# Altium project CNC_interfaces_board.PrjPcb
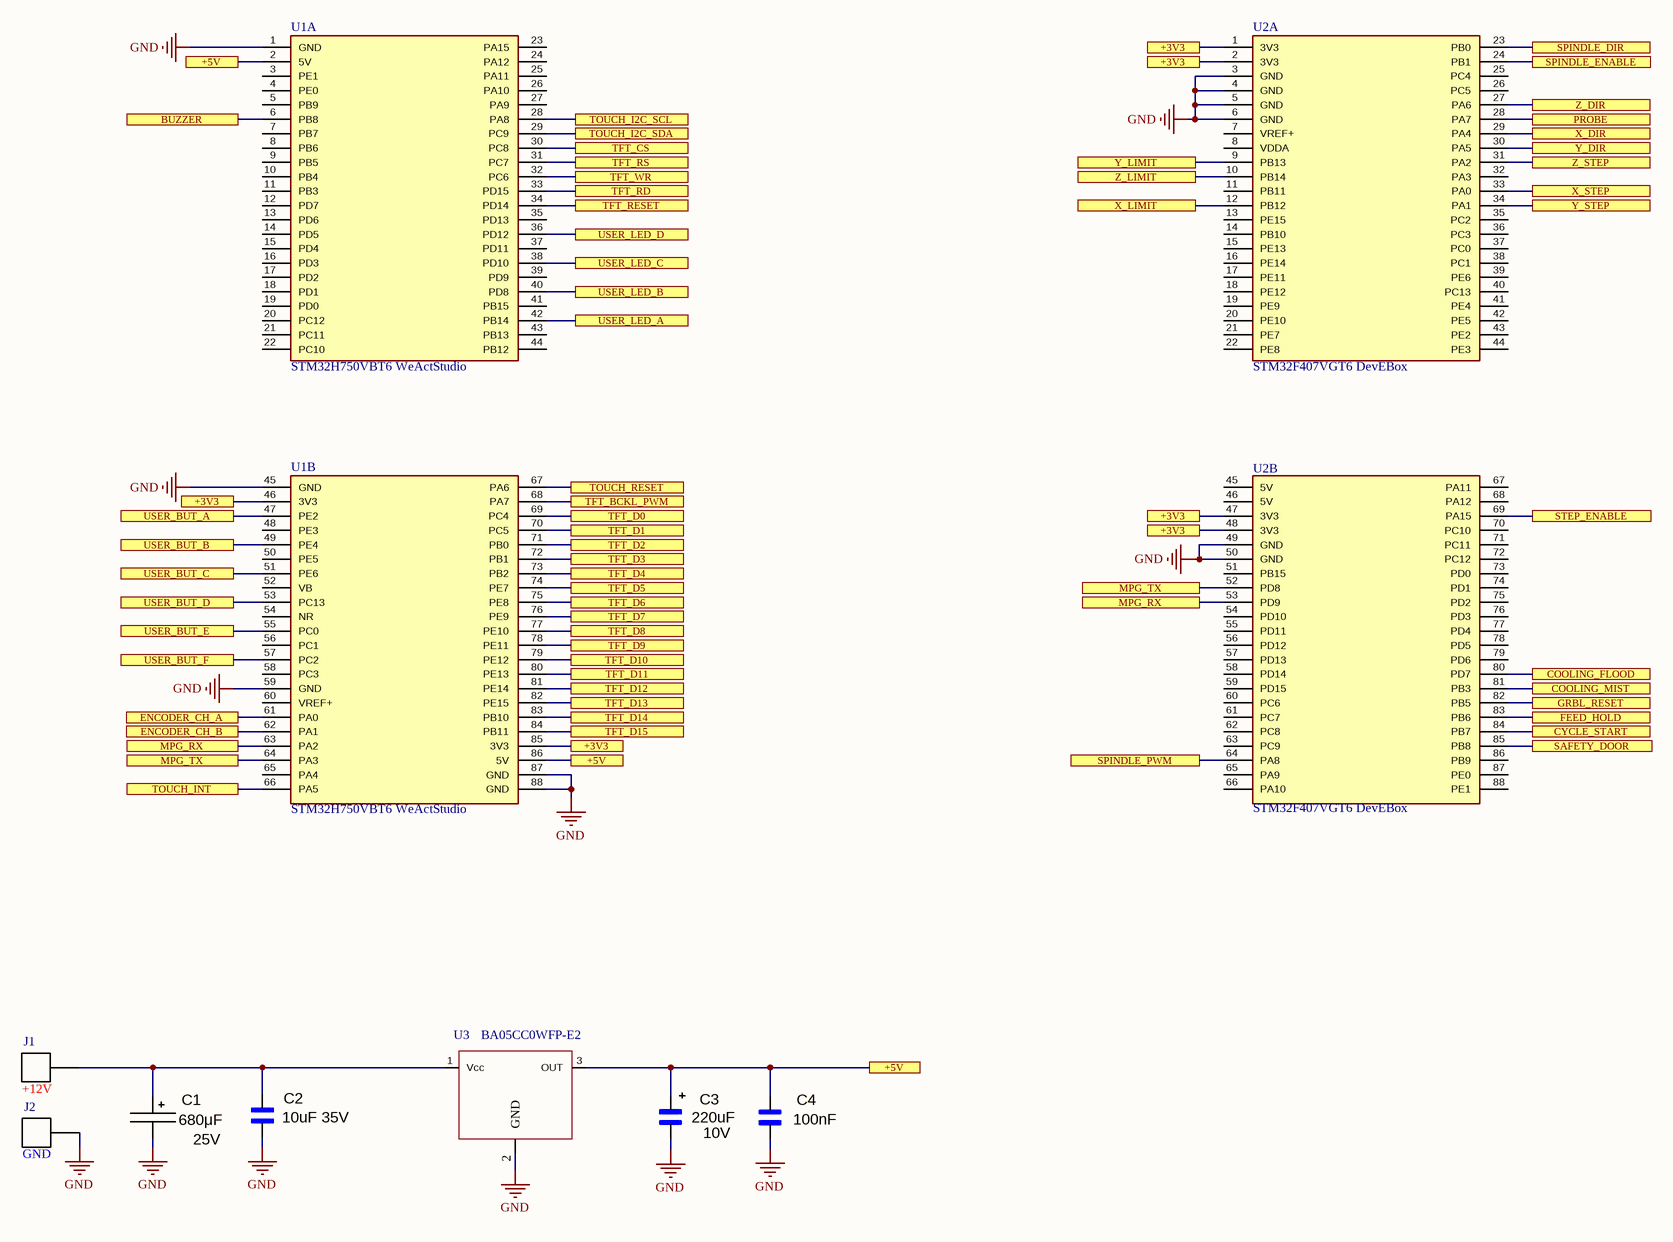
[diagram p0: Sheet1.SchDoc]
5 sheets, 122 parts. Net scope: flat (ports and power ports of the same name join across sheets).
Board file: PCB2.PcbDoc
Sheets:
  Sheet1.SchDoc
  Sheet2.SchDoc
  Sheet3.SchDoc
  Sheet4.SchDoc
  Sheet5.SchDoc

## Sheet Sheet1.SchDoc: Наименование
size 420 x 297 mm; ApprovedBy: Vasil; CheckedBy: Vasil; Author: Vasil; CompanyName: Vasil; DrawnBy: n.a.; Engineer: Vasil; SheetNumber: 1; SheetTotal: 5; PageSetup: Record=PageOptions|CenterHorizontal=True|CenterVertical=True|PrintScale=0.94|XCorrection=1.00|YCorrection=1.00|PrintKind=1|BorderSize=5000000|LeftOffset=0|BottomOffset=0|Orientation=1|PaperLength=1000|PaperWidth=1000|Scale=100|PaperSource=7|PrintQuality=-4|MediaType=1|DitherType=10|PaperKind=A4|PrintScaleMode=1; DecimalNumber: 000.00006.001.VG; HeadOfSector: n.a.; MainDevice: HW; Name: CNC control panel; DocumentName: Sheet1.SCHDOC

### Parts
C1  value 680μF  Voltage: 25V  [CAP 10x16]  (hidden comment: 680μF / 25V)
C2  10uF 35V  [*CAPC3326X230N]
C3  Voltage: 10V  [SMD 7343-43]  (hidden comment: 220uF)
C4  100nF  [SMD 0603]
J1  +12V  [Wire]
J2  GND  [Wire]
U1  STM32H750VBT6 WeActStudio  [WeActStudio STM32H750VBT6]  (parts A,B of 2)
U2  STM32F407VGT6 DevEBox  [DevEBox V3.0 STM32F407VGT6]  (parts A,B of 2)
U3  BA05CC0WFP-E2  [DPAK228P968X238-4N]

### Ports
+3V3, +5V, BUZZER, COOLING_FLOOD, COOLING_MIST, CYCLE_START, ENCODER_CH_A, ENCODER_CH_B, FEED_HOLD, GRBL_RESET, MPG_RX, MPG_TX, PROBE, SAFETY_DOOR, SPINDLE_DIR, SPINDLE_ENABLE, SPINDLE_PWM, STEP_ENABLE, TFT_BCKL_PWM, TFT_CS, TFT_D0, TFT_D1, TFT_D2, TFT_D3, TFT_D4, TFT_D5, TFT_D6, TFT_D7, TFT_D8, TFT_D9, TFT_D10, TFT_D11, TFT_D12, TFT_D13, TFT_D14, TFT_D15, TFT_RD, TFT_RESET, TFT_RS, TFT_WR, TOUCH_I2C_SCL, TOUCH_I2C_SDA, TOUCH_INT, TOUCH_RESET, USER_BUT_A, USER_BUT_B, USER_BUT_C, USER_BUT_D, USER_BUT_E, USER_BUT_F, USER_LED_A, USER_LED_B, USER_LED_C, USER_LED_D, X_DIR, X_LIMIT, X_STEP, Y_DIR, Y_LIMIT, Y_STEP, Z_DIR, Z_LIMIT, Z_STEP

### Nets
GND: C1.2 C2.1 C3.2 C4.1 J2.1 U1.1(GND) U1.45(GND) U1.59(GND) U1.87(GND) U1.88(GND) U2.3(GND) U2.4(GND) U2.5(GND) U2.6(GND) U2.49(GND) U2.50(GND) U3.2(GND)
NetC1_1: C1.1 C2.2 J1.1 U3.1(Vcc)
NetC3_1: C3.1 C4.2 U1.2(5V) U1.86(5V) U3.3(OUT) ; port +5V
NetJ3_6: U1.46(3V3) U1.85(3V3) U2.1(3V3) U2.2(3V3) U2.47(3V3) U2.48(3V3) ; port +3V3
NetJ3_9: U1.30(PC8) ; port TFT_CS
NetJ3_10: U1.31(PC7) ; port TFT_RS
NetJ3_11: U1.32(PC6) ; port TFT_WR
NetJ3_12: U1.33(PD15) ; port TFT_RD
NetJ3_15: U1.34(PD14) ; port TFT_RESET
NetJ3_17: U1.69(PC4) ; port TFT_D0
NetJ3_18: U1.70(PC5) ; port TFT_D1
NetJ3_19: U1.71(PB0) ; port TFT_D2
NetJ3_20: U1.72(PB1) ; port TFT_D3
NetJ3_21: U1.73(PB2) ; port TFT_D4
NetJ3_22: U1.74(PE7) ; port TFT_D5
NetJ3_23: U1.75(PE8) ; port TFT_D6
NetJ3_24: U1.76(PE9) ; port TFT_D7
NetJ3_25: U1.77(PE10) ; port TFT_D8
NetJ3_26: U1.78(PE11) ; port TFT_D9
NetJ3_27: U1.79(PE12) ; port TFT_D10
NetJ3_28: U1.80(PE13) ; port TFT_D11
NetJ3_29: U1.81(PE14) ; port TFT_D12
NetJ3_30: U1.82(PE15) ; port TFT_D13
NetJ3_31: U1.83(PB10) ; port TFT_D14
NetJ3_32: U1.84(PB11) ; port TFT_D15
NetJ8_2: U1.28(PA8) ; port TOUCH_I2C_SCL
NetJ8_3: U1.29(PC9) ; port TOUCH_I2C_SDA
NetJ8_4: U1.66(PA5) ; port TOUCH_INT
NetJ8_5: U1.67(PA6) ; port TOUCH_RESET
NetJ10_1: U1.62(PA1) ; port ENCODER_CH_B
NetJ10_2: U1.61(PA0) ; port ENCODER_CH_A
NetQ2_3: U2.82(PB5) ; port GRBL_RESET
NetQ4_3: U2.12(PB12) ; port X_LIMIT
NetQ5_3: U2.9(PB13) ; port Y_LIMIT
NetQ6_3: U2.10(PB14) ; port Z_LIMIT
NetQ7_3: U2.28(PA7) ; port PROBE
NetQ9_3: U2.83(PB6) ; port FEED_HOLD
NetQ10_3: U2.84(PB7) ; port CYCLE_START
NetQ11_3: U2.85(PB8) ; port SAFETY_DOOR
NetQ15_1: U2.24(PB1) ; port SPINDLE_ENABLE
NetQ16_1: U2.23(PB0) ; port SPINDLE_DIR
NetQ17_1: U2.64(PA8) ; port SPINDLE_PWM
NetQ18_1: U2.33(PA0) ; port X_STEP
NetQ19_1: U2.34(PA1) ; port Y_STEP
NetQ20_1: U2.31(PA2) ; port Z_STEP
NetQ22_1: U2.29(PA4) ; port X_DIR
NetQ23_1: U2.30(PA5) ; port Y_DIR
NetQ24_1: U2.27(PA6) ; port Z_DIR
NetQ26_1: U2.69(PA15) ; port STEP_ENABLE
NetR10_2: U1.47(PE2) ; port USER_BUT_A
NetR11_2: U1.49(PE4) ; port USER_BUT_B
NetR12_2: U1.51(PE6) ; port USER_BUT_C
NetR13_2: U1.53(PC13) ; port USER_BUT_D
NetR14_2: U1.55(PC0) ; port USER_BUT_E
NetR15_2: U1.57(PC2) ; port USER_BUT_F
NetR16_1: U1.42(PB14) ; port USER_LED_A
NetR17_1: U1.40(PD8) ; port USER_LED_B
NetR18_1: U1.38(PD10) ; port USER_LED_C
NetR19_1: U1.36(PD12) ; port USER_LED_D
NetR20_1: U1.6(PB8) ; port BUZZER
NetR46_1: U2.81(PB3) ; port COOLING_MIST
NetR47_1: U2.80(PD7) ; port COOLING_FLOOD
NetR56_1: U1.68(PA7) ; port TFT_BCKL_PWM
NetU1_63: U1.63(PA2) U2.53(PD9) ; port MPG_RX
NetU1_64: U1.64(PA3) U2.52(PD8) ; port MPG_TX

Not connected (* = marked no-connect by the designer): U1 3(PE1) 4(PE0) 5(PB9) 7(PB7) 8(PB6) 9(PB5) 10(PB4) 11(PB3) 12(PD7) 13(PD6) 14(PD5) 15(PD4) 16(PD3) 17(PD2) 18(PD1) 19(PD0) 20(PC12) 21(PC11) 22(PC10) 23(PA15) 24(PA12) 25(PA11) 26(PA10) 27(PA9) 35(PD13) 37(PD11) 39(PD9) 41(PB15) 43(PB13) 44(PB12) 48(PE3) 50(PE5) 52(VB) 54(NR) 56(PC1) 58(PC3) 60(VREF+) 65(PA4); U2 7(VREF+) 8(VDDA) 11(PB11) 13(PE15) 14(PB10) 15(PE13) 16(PE14) 17(PE11) 18(PE12) 19(PE9) 20(PE10) 21(PE7) 22(PE8) 25(PC4) 26(PC5) 32(PA3) 35(PC2) 36(PC3) 37(PC0) 38(PC1) 39(PE6) 40(PC13) 41(PE4) 42(PE5) 43(PE2) 44(PE3) 45(5V) 46(5V) 51(PB15) 54(PD10) 55(PD11) 56(PD12) 57(PD13) 58(PD14) 59(PD15) 60(PC6) 61(PC7) 62(PC8) 63(PC9) 65(PA9) 66(PA10) 67(PA11) 68(PA12) 70(PC10) 71(PC11) 72(PC12) 73(PD0) 74(PD1) 75(PD2) 76(PD3) 77(PD4) 78(PD5) 79(PD6) 86(PB9) 87(PE0) 88(PE1)

### Notes on the sheet
- Перв.примен.
- Справ.№
- Подп. и дата
- Инв.№ дубл.
- Взам.инв.№
- Подп.и дата
- Разраб.
- Изм.
- Лист
- № докум.
- Подп.
- Дата
- Лит.
- Масштаб
- Масса
- Т.контр.
- Пров.
- СХЕМА   ЭЛЕКТРИЧЕСКАЯ
- ПРИНЦИПИАЛЬНАЯ
- Листов
- Инв.№ подл.
- Утв.
- Н.контр.
- Нач.сект.
- Формат  A3

### Library data of the parts
C1 = CAP Aluminium: Manufacturer: FUJICON; Tipe: Low ESR; Case: ТМ1V221M-RBF16; Package: 8x16x3.5; HelpURL: https://store.comet.bg/Catalogue/Product/6157/; Temperature: -55...+105°C
C2 C4 = CL32B106KLJNNNE: C1210 10uF 35V X7R; Manufacturer: SAMSUNG ELECTRO-MECHANICS; HelpURL: https://store.comet.bg/Catalogue/Product/36844/; Model: CL32B106KLJNNNE; Case: SMD 1210
  C2: Value: 10uF; Voltage: 35V
  C4: Value: 100nF
C3 = Cap Tant 220uF 10V Case E: Cap Tant Solid 220uF 10V E CASE 10% _7.3 X 4.3 X 4mm_ SMD 7343-43 0.1 Ohm 125В°C T/R; Manufacturer: VISHAY; Model: 593D227X9010E2TE3; HalpURL: https://store.comet.bg/Catalogue/Product/15617/; Package: SMD 7343-43   7.3 x 4.3 x 4; Value: 220uF
J1 J2 = Wire
U3 = BA05CC0FP-E2: LDO Regulator; Manufacturer: ROHM Semiconductor; Model: BA05CC0WFP-E2; HelpURL: https://store.comet.bg/Catalogue/Product/4871/; Case: TO252-5-11

## Sheet Sheet2.SchDoc: Наименование
size 420 x 297 mm; ApprovedBy: Vasil; CheckedBy: Vasil; Author: Vasil; CompanyName: Vasil; DrawnBy: n.a.; Engineer: Vasil; SheetNumber: 2; SheetTotal: 5; PageSetup: Record=PageOptions|CenterHorizontal=True|CenterVertical=True|PrintScale=0.94|XCorrection=1.00|YCorrection=1.00|PrintKind=1|BorderSize=5000000|LeftOffset=0|BottomOffset=0|Orientation=1|PaperLength=1000|PaperWidth=1000|Scale=100|PaperSource=7|PrintQuality=-4|MediaType=1|DitherType=10|PaperKind=A4|PrintScaleMode=1; DecimalNumber: 000.00006.001.VG; HeadOfSector: n.a.; MainDevice: HW; Name: CNC_interfaces_board; DocumentName: Sheet1.SCHDOC
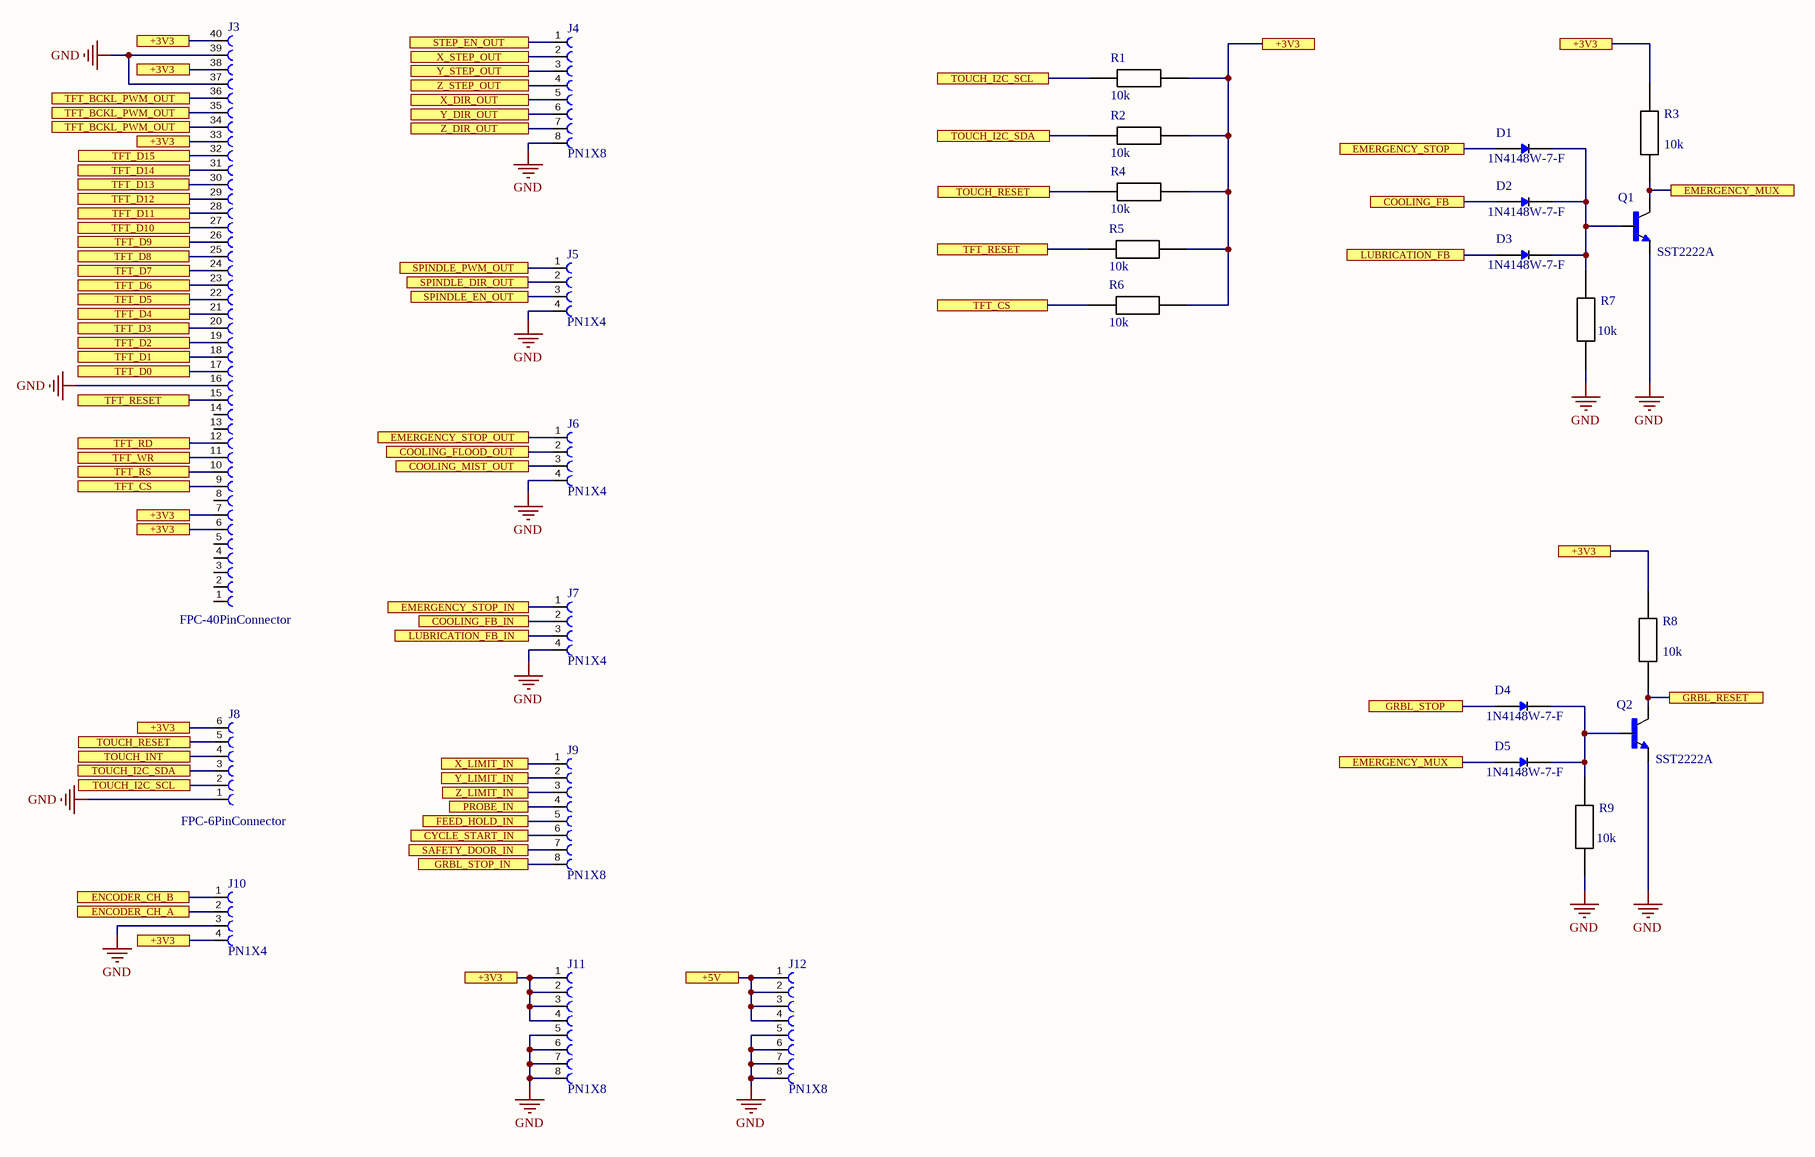
[diagram p1: Sheet2.SchDoc]

### Parts
D1  1N4148W-7-F  [SOD123]
D2  1N4148W-7-F  [SOD123]
D3  1N4148W-7-F  [SOD123]
D4  1N4148W-7-F  [SOD123]
D5  1N4148W-7-F  [SOD123]
J3  FPC-40PinConnector  [687140149022]
J4  PN1X8  [PN1X8]
J5  PN1X4  [PN1X4]
J6  PN1X4  [PN1X4]
J7  PN1X4  [PN1X4]
J8  FPC-6PinConnector  [687106149022]
J9  PN1X8  [PN1X8]
J10  PN1X4  [PN1X4]
J11  PN1X8  [PN1X8]
J12  PN1X8  [PN1X8]
Q1  SST2222A  [SOT-23-3]
Q2  SST2222A  [SOT-23-3]
R1  10k  [SMD 0805]
R2  10k  [SMD 0805]
R3  10k  [SMD 0805]
R4  10k  [SMD 0805]
R5  10k  [SMD 0805]
R6  10k  [SMD 0805]
R7  10k  [SMD 0805]
R8  10k  [SMD 0805]
R9  10k  [SMD 0805]

### Ports
+3V3, +5V, COOLING_FB, COOLING_FB_IN, COOLING_FLOOD_OUT, COOLING_MIST_OUT, CYCLE_START_IN, EMERGENCY_MUX, EMERGENCY_STOP, EMERGENCY_STOP_IN, EMERGENCY_STOP_OUT, ENCODER_CH_A, ENCODER_CH_B, FEED_HOLD_IN, GRBL_RESET, GRBL_STOP, GRBL_STOP_IN, LUBRICATION_FB, LUBRICATION_FB_IN, PROBE_IN, SAFETY_DOOR_IN, SPINDLE_DIR_OUT, SPINDLE_EN_OUT, SPINDLE_PWM_OUT, STEP_EN_OUT, TFT_BCKL_PWM_OUT, TFT_CS, TFT_D0, TFT_D1, TFT_D2, TFT_D3, TFT_D4, TFT_D5, TFT_D6, TFT_D7, TFT_D8, TFT_D9, TFT_D10, TFT_D11, TFT_D12, TFT_D13, TFT_D14, TFT_D15, TFT_RD, TFT_RESET, TFT_RS, TFT_WR, TOUCH_I2C_SCL, TOUCH_I2C_SDA, TOUCH_INT, TOUCH_RESET, X_DIR_OUT, X_LIMIT_IN, X_STEP_OUT, Y_DIR_OUT, Y_LIMIT_IN, Y_STEP_OUT, Z_DIR_OUT, Z_LIMIT_IN, Z_STEP_OUT

### Nets
GND: J3.16 J3.37 J3.39 J4.8 J5.4 J6.4 J7.4 J8.1 J10.3 J11.5 J11.6 J11.7 J11.8 J12.5 J12.6 J12.7 J12.8 Q1.2(E) Q2.2(E) R7.2 R9.2
Net1_4: J6.3 ; port COOLING_MIST_OUT
Net2_4: J6.2 ; port COOLING_FLOOD_OUT
Net3_4: J6.1 ; port EMERGENCY_STOP_OUT
NetC3_1: J12.1 J12.2 J12.3 J12.4 ; port +5V
NetD1_A: D1.A ; port EMERGENCY_STOP
NetD1_C: D1.C(K) D2.C(K) D3.C(K) Q1.1(B) R7.1
NetD2_A: D2.A ; port COOLING_FB
NetD3_A: D3.A ; port LUBRICATION_FB
NetD4_A: D4.A ; port GRBL_STOP
NetD4_C: D4.C(K) D5.C(K) Q2.1(B) R9.1
NetD5_A: D5.A Q1.3(C) R3.2 ; port EMERGENCY_MUX
NetJ3_6: J3.6 J3.7 J3.33 J3.38 J3.40 J8.6 J10.4 J11.1 J11.2 J11.3 J11.4 R1.1 R2.2 R3.1 R4.2 R5.1 R6.1 R8.1 ; port +3V3
NetJ3_9: J3.9 R6.2 ; port TFT_CS
NetJ3_10: J3.10 ; port TFT_RS
NetJ3_11: J3.11 ; port TFT_WR
NetJ3_12: J3.12 ; port TFT_RD
NetJ3_15: J3.15 R5.2 ; port TFT_RESET
NetJ3_17: J3.17 ; port TFT_D0
NetJ3_18: J3.18 ; port TFT_D1
NetJ3_19: J3.19 ; port TFT_D2
NetJ3_20: J3.20 ; port TFT_D3
NetJ3_21: J3.21 ; port TFT_D4
NetJ3_22: J3.22 ; port TFT_D5
NetJ3_23: J3.23 ; port TFT_D6
NetJ3_24: J3.24 ; port TFT_D7
NetJ3_25: J3.25 ; port TFT_D8
NetJ3_26: J3.26 ; port TFT_D9
NetJ3_27: J3.27 ; port TFT_D10
NetJ3_28: J3.28 ; port TFT_D11
NetJ3_29: J3.29 ; port TFT_D12
NetJ3_30: J3.30 ; port TFT_D13
NetJ3_31: J3.31 ; port TFT_D14
NetJ3_32: J3.32 ; port TFT_D15
NetJ3_34: J3.34 J3.35 J3.36 ; port TFT_BCKL_PWM_OUT
NetJ4_1: J4.1 ; port STEP_EN_OUT
NetJ4_2: J4.2 ; port X_STEP_OUT
NetJ4_3: J4.3 ; port Y_STEP_OUT
NetJ4_4: J4.4 ; port Z_STEP_OUT
NetJ4_5: J4.5 ; port X_DIR_OUT
NetJ4_6: J4.6 ; port Y_DIR_OUT
NetJ4_7: J4.7 ; port Z_DIR_OUT
NetJ5_1: J5.1 ; port SPINDLE_PWM_OUT
NetJ5_2: J5.2 ; port SPINDLE_DIR_OUT
NetJ5_3: J5.3 ; port SPINDLE_EN_OUT
NetJ7_1: J7.1 ; port EMERGENCY_STOP_IN
NetJ7_2: J7.2 ; port COOLING_FB_IN
NetJ7_3: J7.3 ; port LUBRICATION_FB_IN
NetJ8_2: J8.2 R1.2 ; port TOUCH_I2C_SCL
NetJ8_3: J8.3 R2.1 ; port TOUCH_I2C_SDA
NetJ8_4: J8.4 ; port TOUCH_INT
NetJ8_5: J8.5 R4.1 ; port TOUCH_RESET
NetJ9_1: J9.1 ; port X_LIMIT_IN
NetJ9_2: J9.2 ; port Y_LIMIT_IN
NetJ9_3: J9.3 ; port Z_LIMIT_IN
NetJ9_4: J9.4 ; port PROBE_IN
NetJ9_5: J9.5 ; port FEED_HOLD_IN
NetJ9_6: J9.6 ; port CYCLE_START_IN
NetJ9_7: J9.7 ; port SAFETY_DOOR_IN
NetJ9_8: J9.8 ; port GRBL_STOP_IN
NetJ10_1: J10.1 ; port ENCODER_CH_B
NetJ10_2: J10.2 ; port ENCODER_CH_A
NetQ2_3: Q2.3(C) R8.2 ; port GRBL_RESET

Not connected (* = marked no-connect by the designer): J3 1(40) 2(39) 3(38) 4(37) 5(36) 8(33) 13(28) 14(27)

### Notes on the sheet
- Перв.примен.
- Справ.№
- Подп. и дата
- Инв.№ дубл.
- Взам.инв.№
- Подп.и дата
- Разраб.
- Изм.
- Лист
- № докум.
- Подп.
- Дата
- Лит.
- Масштаб
- Масса
- Т.контр.
- Пров.
- СХЕМА   ЭЛЕКТРИЧЕСКАЯ
- ПРИНЦИПИАЛЬНАЯ
- Листов
- Инв.№ подл.
- Утв.
- Н.контр.
- Нач.сект.
- Формат  A3

### Library data of the parts
D1-D5 = 1N4148W-7-F: Diode Standard 100V 300mA _DC_ Surface Mount SOD-123; MF: DIODES / ZETEX; HelpURL: https://store.comet.bg/Catalogue/Product/9613/; Model: 1N4148W-7-F; Case: SOD-123 Diodes Inc.; Value: 1N4148W-7-F
J3 = FPC-40PinConnector: 40 Position FFC, FPC Connector Contacts, Bottom 0.020 (0.50mm) Surface Mount, Right Angle; MF: Wurth Electronics; Value: FPC-40PinConnector; Check_prices: https://www.snapeda.com/parts/687140149022/Wurth+Electronics+Inc./view-part/?ref=eda; MP: 687140149022; Purchase-URL: https://pricing.snapeda.com/search/part/687140149022/?ref=eda; Price: None; Availability: In Stock; Package: None; SnapEDA_Link: https://www.snapeda.com/parts/687140149022/Wurth+Electronics+Inc./view-part/?ref=snap
J4 J9 J11 J12 = PN1X8: Single Row / Straight / Without Shroud Female header Female 8 ¦ WÃ¼rth Elektronik 61300711821 @ Pin header, socket _Si...; MF: WÃ¼rth Elektronik; Value: PN1X8; Price: None; MP: 61300711821; SnapEDA_Link: https://www.snapeda.com/parts/61300711821/W%C3%BCrth%20Elektronik/view-part/2704590/?ref=snap; Package: None; Availability: Unavailable
J5-J7 J10 = PN1X4: Single Row / Straight / Without Shroud Female header Female 4 @ Pin header, socket _Si...; MF: WÃ¼rth Elektronik; MP: 61300711821; Value: PN1X4; Price: None; SnapEDA_Link: https://www.snapeda.com/parts/61300711821/W%C3%BCrth%20Elektronik/view-part/2704590/?ref=snap; Package: None; Availability: Unavailable
J8 = FPC-6PinConnector: 6 Position FFC, FPC Connector Contacts, Bottom 0.020 (0.50mm) Surface Mount, Right Angle; MF: WÃ¼rth Elektronik; MP: 687106149022; Purchase-URL: https://pricing.snapeda.com/search/part/687106149022/?ref=eda; Price: None; SnapEDA_Link: https://www.snapeda.com/parts/687106149022/Wurth+Elektronik/view-part/?ref=snap; Check_prices: https://www.snapeda.com/parts/687106149022/Wurth+Elektronik/view-part/?ref=eda; Package: None; Availability: In Stock; Value: FPC-6PinConnector
Q1 Q2 = SST2222A: Transistor NPN 40V 600mA 300MHz 350mW; Manufacturer: ROHM Semiconductor; Case: SOT-23-3 SST3; HelpURL: https://store.comet.bg/Catalogue/Product/23715/; Value: SST2222A
R1-R9 = Resistor_1: RES; HelpURL: https://store.comet.bg/Catalogue/RES/Resistors/#eyJpcHAiOiIxMDAiLCJtIjoiIn0%3D; Value: 10k

## Sheet Sheet3.SchDoc: Наименование
size 420 x 297 mm; ApprovedBy: Vasil; CheckedBy: Vasil; Author: Vasil; CompanyName: Vasil; DrawnBy: n.a.; Engineer: Vasil; SheetNumber: 3; SheetTotal: 5; PageSetup: Record=PageOptions|CenterHorizontal=True|CenterVertical=True|PrintScale=0.94|XCorrection=1.00|YCorrection=1.00|PrintKind=1|BorderSize=5000000|LeftOffset=0|BottomOffset=0|Orientation=1|PaperLength=1000|PaperWidth=1000|Scale=100|PaperSource=7|PrintQuality=-4|MediaType=1|DitherType=10|PaperKind=A4|PrintScaleMode=1; DecimalNumber: 000.00006.001.VG; HeadOfSector: n.a.; MainDevice: HW; Name: CNC_interfaces_board; DocumentName: Sheet1.SCHDOC
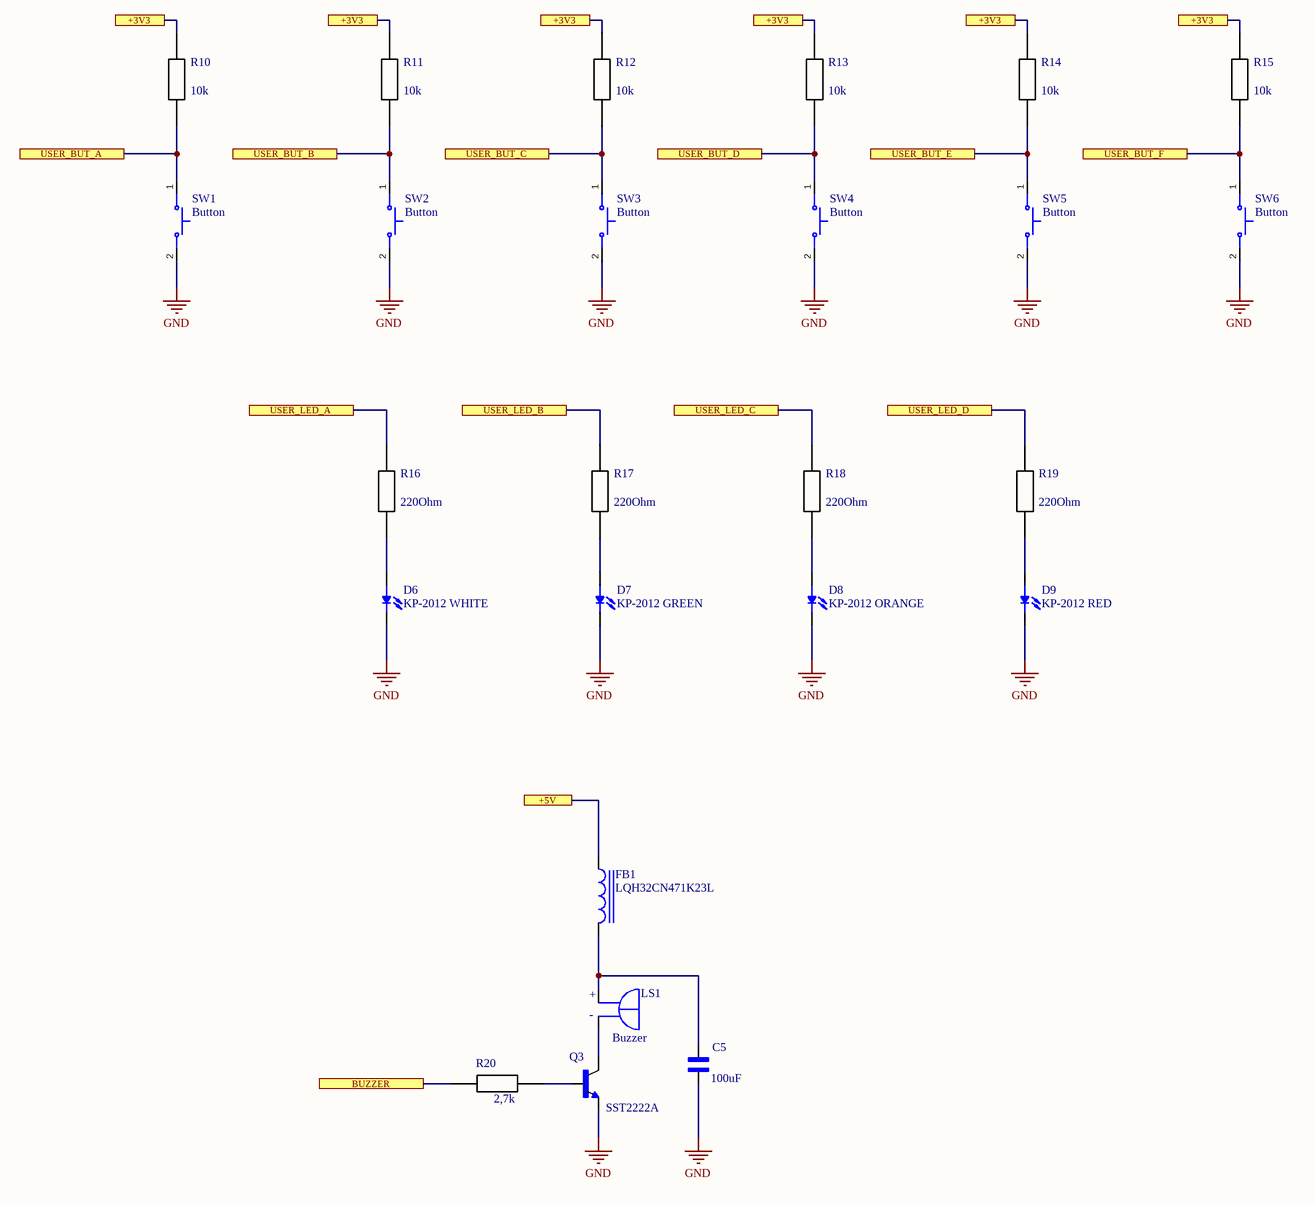
[diagram p2: Sheet3.SchDoc]

### Parts
C5  100uF  [*CAPC3326X230N]
D6  KP-2012 WHITE  [SMD 0805 LED-Y]
D7  KP-2012 GREEN  [SMD 0805 LED-Y]
D8  KP-2012 ORANGE  [SMD 0805 LED-Y]
D9  KP-2012 RED  [SMD 0805 LED-Y]
FB1  LQH32CN471K23L  [SMD 1210 LQH]
LS1  Buzzer  [XDCR_KSSG13J12-N]
Q3  SST2222A  [SOT-23-3]
R10  10k  [SMD 0805]
R11  10k  [SMD 0805]
R12  10k  [SMD 0805]
R13  10k  [SMD 0805]
R14  10k  [SMD 0805]
R15  10k  [SMD 0805]
R16  220Ohm  [SMD 0805]
R17  220Ohm  [SMD 0805]
R18  220Ohm  [SMD 0805]
R19  220Ohm  [SMD 0805]
R20  2,7k  [SMD 0805]
SW1  Button  [SW_KSR221GLFS]
SW2  Button  [SW_KSR221GLFS]
SW3  Button  [SW_KSR221GLFS]
SW4  Button  [SW_KSR221GLFS]
SW5  Button  [SW_KSR221GLFS]
SW6  Button  [SW_KSR221GLFS]

### Ports
+3V3, +5V, BUZZER, USER_BUT_A, USER_BUT_B, USER_BUT_C, USER_BUT_D, USER_BUT_E, USER_BUT_F, USER_LED_A, USER_LED_B, USER_LED_C, USER_LED_D

### Nets
GND: C5.1 D6.C D7.C D8.C D9.C Q3.2(E) SW1.2 SW2.2 SW3.2 SW4.2 SW5.2 SW6.2
NetC3_1: FB1.1 ; port +5V
NetC5_2: C5.2 FB1.2 LS1.P(POS)
NetD6_A: D6.A R16.2
NetD7_A: D7.A R17.2
NetD8_A: D8.A R18.2
NetD9_A: D9.A R19.2
NetJ3_6: R10.1 R11.1 R12.1 R13.1 R14.1 R15.1 ; port +3V3
NetLS1_N: LS1.N(NEG) Q3.3(C)
NetQ3_1: Q3.1(B) R20.2
NetR10_2: R10.2 SW1.1 ; port USER_BUT_A
NetR11_2: R11.2 SW2.1 ; port USER_BUT_B
NetR12_2: R12.2 SW3.1 ; port USER_BUT_C
NetR13_2: R13.2 SW4.1 ; port USER_BUT_D
NetR14_2: R14.2 SW5.1 ; port USER_BUT_E
NetR15_2: R15.2 SW6.1 ; port USER_BUT_F
NetR16_1: R16.1 ; port USER_LED_A
NetR17_1: R17.1 ; port USER_LED_B
NetR18_1: R18.1 ; port USER_LED_C
NetR19_1: R19.1 ; port USER_LED_D
NetR20_1: R20.1 ; port BUZZER

### Notes on the sheet
- Перв.примен.
- Справ.№
- Подп. и дата
- Инв.№ дубл.
- Взам.инв.№
- Подп.и дата
- Разраб.
- Изм.
- Лист
- № докум.
- Подп.
- Дата
- Лит.
- Масштаб
- Масса
- Т.контр.
- Пров.
- СХЕМА   ЭЛЕКТРИЧЕСКАЯ
- ПРИНЦИПИАЛЬНАЯ
- Листов
- Инв.№ подл.
- Утв.
- Н.контр.
- Нач.сект.
- Формат  A3
- (in symbol KSSG13J12-N) +; -

### Library data of the parts
C5 = CL32B106KLJNNNE: as C2 on sheet Sheet1; HelpURL: https://store.comet.bg/Catalogue/Product/36844/; Model: CL32B106KLJNNNE; Case: SMD 1210; Value: 100uF
D6-D9 = KP-2012: LED 2.0x1.25mm, 50-160 mcd@20mA, W.Clear, 120°; MP: SMLMN2WB1CW1C; MF: Rohm Semiconductor; SnapEDA_Link: https://www.snapeda.com/parts/SMLMN2WB1CW1C/Rohm/view-part/3217279/?ref=snap; Availability: Unavailable; Value: KP-2012; Price: None; Package: 0805 Rohm Semiconductor
FB1 = LQH32CN471K23L: 470uH 19Ohm 60mA 10%    47uH 1.3Ohm 170mA 10%; MF: MURATA ELECTRONICS; Package: 1210; MP: LQH32CN471K; URL 47uH: https://store.comet.bg/Catalogue/Product/48001/; URL 470uH: https://store.comet.bg/Catalogue/Product/48004/; Value: LQH32CN471K23L
LS1 = KSSG13J12-N: Availability: Unavailable; Price: None; Package: None; Value: Buzzer; MP: KSSG13J12-N
Q3 = SST2222A: as Q1 on sheet Sheet2; Case: SOT-23-3 SST3; HelpURL: https://store.comet.bg/Catalogue/Product/23715/; Value: SST2222A
R10-R20 = Resistor_1: RES; HelpURL: https://store.comet.bg/Catalogue/RES/Resistors/#eyJpcHAiOiIxMDAiLCJtIjoiIn0%3D
  R10-R15: Value: 10k
  R16-R19: Value: 220Ohm
  R20: Value: 2,7k
SW1-SW6 = KSR221GLFS: Tactile Switch 2p SPST-NO 50mA/32V 6x3.8x2.5mm; MF: C&K; MP: KSR221GLFS; Package: 6x3.8x2.5mm; URL: https://store.comet.bg/Catalogue/Product/17512/; Value: Button

## Sheet Sheet4.SchDoc: Наименование
size 420 x 297 mm; ApprovedBy: Vasil; CheckedBy: Vasil; Author: Vasil; CompanyName: Vasil; DrawnBy: n.a.; Engineer: Vasil; SheetNumber: 4; SheetTotal: 5; PageSetup: Record=PageOptions|CenterHorizontal=True|CenterVertical=True|PrintScale=0.94|XCorrection=1.00|YCorrection=1.00|PrintKind=1|BorderSize=5000000|LeftOffset=0|BottomOffset=0|Orientation=1|PaperLength=1000|PaperWidth=1000|Scale=100|PaperSource=7|PrintQuality=-4|MediaType=1|DitherType=10|PaperKind=A4|PrintScaleMode=1; DecimalNumber: 000.00006.001.VG; HeadOfSector: n.a.; MainDevice: HW; Name: CNC_interfaces_board; DocumentName: Sheet1.SCHDOC
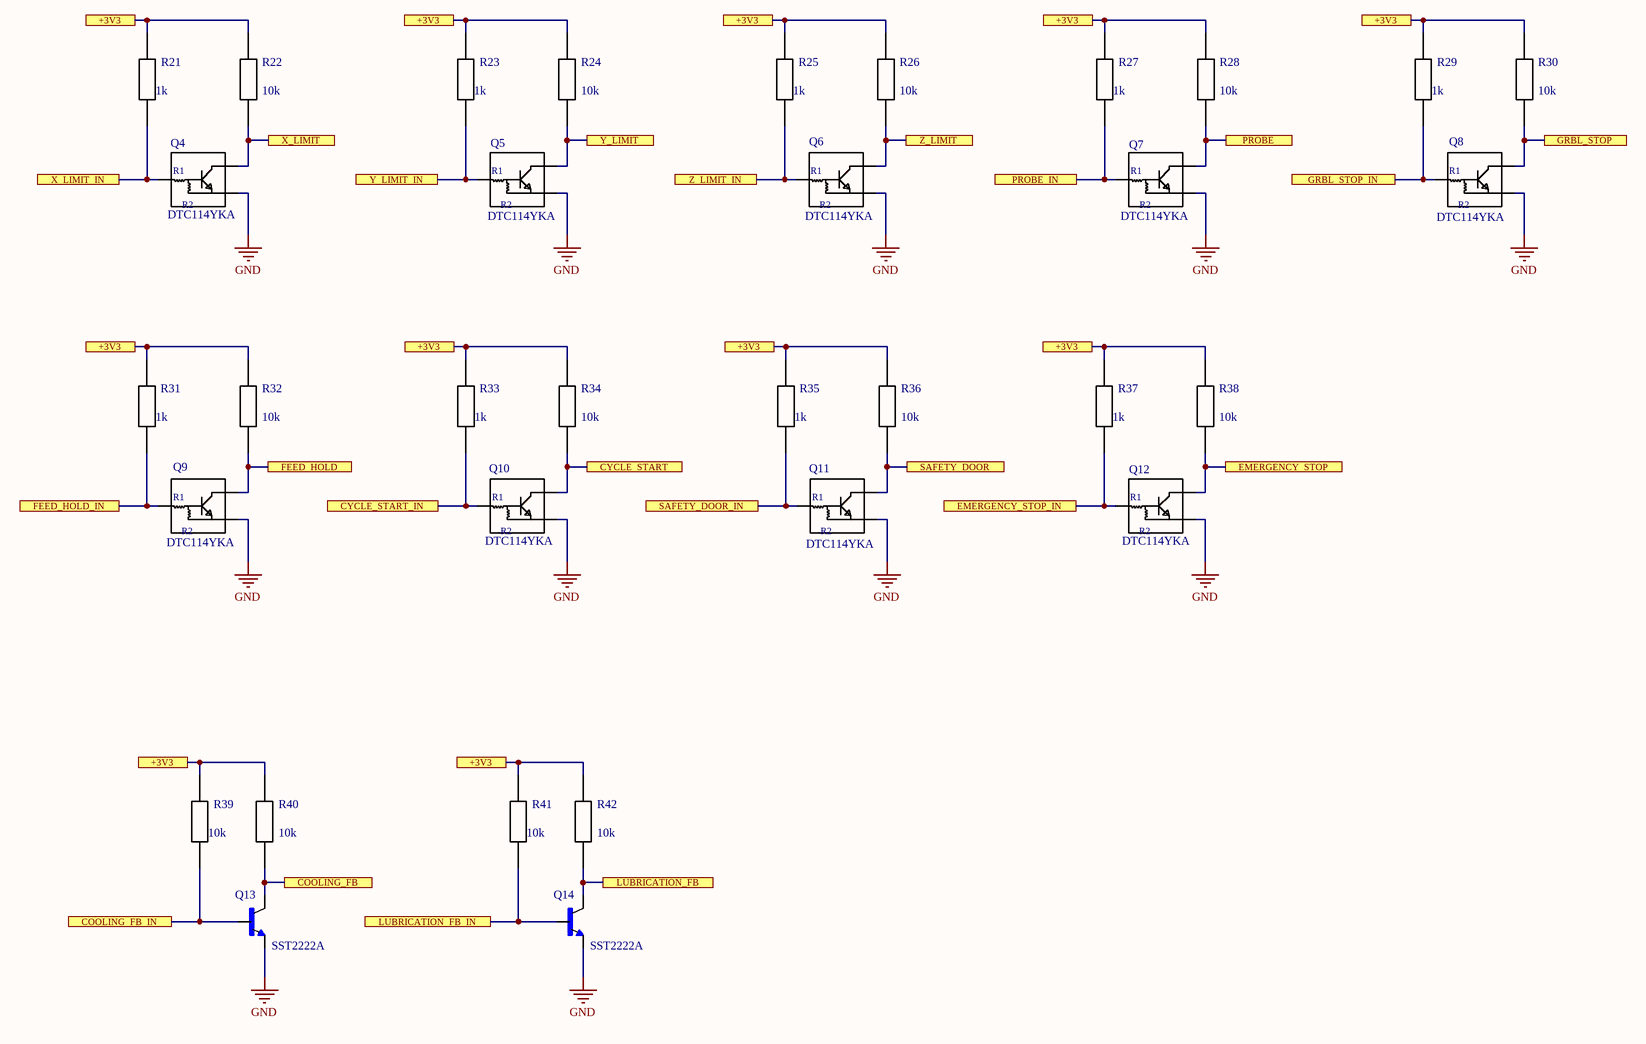
[diagram p3: Sheet4.SchDoc]

### Parts
Q4  DTC114YKA  [SOT-346 (SC59) Black]
Q5  DTC114YKA  [SOT-346 (SC59) Black]
Q6  DTC114YKA  [SOT-346 (SC59) Black]
Q7  DTC114YKA  [SOT-346 (SC59) Black]
Q8  DTC114YKA  [SOT-346 (SC59) Black]
Q9  DTC114YKA  [SOT-346 (SC59) Black]
Q10  DTC114YKA  [SOT-346 (SC59) Black]
Q11  DTC114YKA  [SOT-346 (SC59) Black]
Q12  DTC114YKA  [SOT-346 (SC59) Black]
Q13  SST2222A  [SOT-23-3]
Q14  SST2222A  [SOT-23-3]
R21  1k  [SMD 0805]
R22  10k  [SMD 0805]
R23  1k  [SMD 0805]
R24  10k  [SMD 0805]
R25  1k  [SMD 0805]
R26  10k  [SMD 0805]
R27  1k  [SMD 0805]
R28  10k  [SMD 0805]
R29  1k  [SMD 0805]
R30  10k  [SMD 0805]
R31  1k  [SMD 0805]
R32  10k  [SMD 0805]
R33  1k  [SMD 0805]
R34  10k  [SMD 0805]
R35  1k  [SMD 0805]
R36  10k  [SMD 0805]
R37  1k  [SMD 0805]
R38  10k  [SMD 0805]
R39  10k  [SMD 0805]
R40  10k  [SMD 0805]
R41  10k  [SMD 0805]
R42  10k  [SMD 0805]

### Ports
+3V3, COOLING_FB, COOLING_FB_IN, CYCLE_START, CYCLE_START_IN, EMERGENCY_STOP, EMERGENCY_STOP_IN, FEED_HOLD, FEED_HOLD_IN, GRBL_STOP, GRBL_STOP_IN, LUBRICATION_FB, LUBRICATION_FB_IN, PROBE, PROBE_IN, SAFETY_DOOR, SAFETY_DOOR_IN, X_LIMIT, X_LIMIT_IN, Y_LIMIT, Y_LIMIT_IN, Z_LIMIT, Z_LIMIT_IN

### Nets
GND: Q4.2 Q5.2 Q6.2 Q7.2 Q8.2 Q9.2 Q10.2 Q11.2 Q12.2 Q13.2(E) Q14.2(E)
NetD1_A: Q12.3 R38.2 ; port EMERGENCY_STOP
NetD2_A: Q13.3(C) R40.2 ; port COOLING_FB
NetD3_A: Q14.3(C) R42.2 ; port LUBRICATION_FB
NetD4_A: Q8.3 R30.2 ; port GRBL_STOP
NetJ3_6: R21.1 R22.1 R23.1 R24.1 R25.1 R26.1 R27.1 R28.1 R29.1 R30.1 R31.1 R32.1 R33.1 R34.1 R35.1 R36.1 R37.1 R38.1 R39.1 R40.1 R41.1 R42.1 ; port +3V3
NetJ7_1: Q12.1 R37.2 ; port EMERGENCY_STOP_IN
NetJ7_2: Q13.1(B) R39.2 ; port COOLING_FB_IN
NetJ7_3: Q14.1(B) R41.2 ; port LUBRICATION_FB_IN
NetJ9_1: Q4.1 R21.2 ; port X_LIMIT_IN
NetJ9_2: Q5.1 R23.2 ; port Y_LIMIT_IN
NetJ9_3: Q6.1 R25.2 ; port Z_LIMIT_IN
NetJ9_4: Q7.1 R27.2 ; port PROBE_IN
NetJ9_5: Q9.1 R31.2 ; port FEED_HOLD_IN
NetJ9_6: Q10.1 R33.2 ; port CYCLE_START_IN
NetJ9_7: Q11.1 R35.2 ; port SAFETY_DOOR_IN
NetJ9_8: Q8.1 R29.2 ; port GRBL_STOP_IN
NetQ4_3: Q4.3 R22.2 ; port X_LIMIT
NetQ5_3: Q5.3 R24.2 ; port Y_LIMIT
NetQ6_3: Q6.3 R26.2 ; port Z_LIMIT
NetQ7_3: Q7.3 R28.2 ; port PROBE
NetQ9_3: Q9.3 R32.2 ; port FEED_HOLD
NetQ10_3: Q10.3 R34.2 ; port CYCLE_START
NetQ11_3: Q11.3 R36.2 ; port SAFETY_DOOR

### Notes on the sheet
- Перв.примен.
- Справ.№
- Подп. и дата
- Инв.№ дубл.
- Взам.инв.№
- Подп.и дата
- Разраб.
- Изм.
- Лист
- № докум.
- Подп.
- Дата
- Лит.
- Масштаб
- Масса
- Т.контр.
- Пров.
- СХЕМА   ЭЛЕКТРИЧЕСКАЯ
- ПРИНЦИПИАЛЬНАЯ
- Листов
- Инв.№ подл.
- Утв.
- Н.контр.
- Нач.сект.
- Формат  A3
- (in symbol DTC114YKA) R1; R2

### Library data of the parts
Q4-Q12 = DTC114YKA: NPN Digital 50V 100mA 200mW  R1=10kOm R2=47kOm; Manufacturer: ROHM Semiconductor; Case: SOT-346 (SC59); HalpURL: https://store.comet.bg/Catalogue/Product/23715/; Value: DTC114YKA
Q13 Q14 = SST2222A: as Q1 on sheet Sheet2; Case: SOT-23-3 SST3; HelpURL: https://store.comet.bg/Catalogue/Product/23715/; Value: SST2222A
R21-R42 = Resistor_1: RES; HelpURL: https://store.comet.bg/Catalogue/RES/Resistors/#eyJpcHAiOiIxMDAiLCJtIjoiIn0%3D
  R21 R23 R25 R27 R29 R31 R33 R35 R37: Value: 1k
  R22 R24 R26 R28 R30 R32 R34 R36 R38-R42: Value: 10k

## Sheet Sheet5.SchDoc: Наименование
size 420 x 297 mm; ApprovedBy: Vasil; CheckedBy: Vasil; Author: Vasil; CompanyName: Vasil; DrawnBy: n.a.; Engineer: Vasil; SheetNumber: 5; SheetTotal: 5; PageSetup: Record=PageOptions|CenterHorizontal=True|CenterVertical=True|PrintScale=0.94|XCorrection=1.00|YCorrection=1.00|PrintKind=1|BorderSize=5000000|LeftOffset=0|BottomOffset=0|Orientation=1|PaperLength=1000|PaperWidth=1000|Scale=100|PaperSource=7|PrintQuality=-4|MediaType=1|DitherType=10|PaperKind=A4|PrintScaleMode=1; DecimalNumber: 000.00006.001.VG; HeadOfSector: n.a.; MainDevice: HW; Name: CNC_interfaces_board; DocumentName: Sheet1.SCHDOC
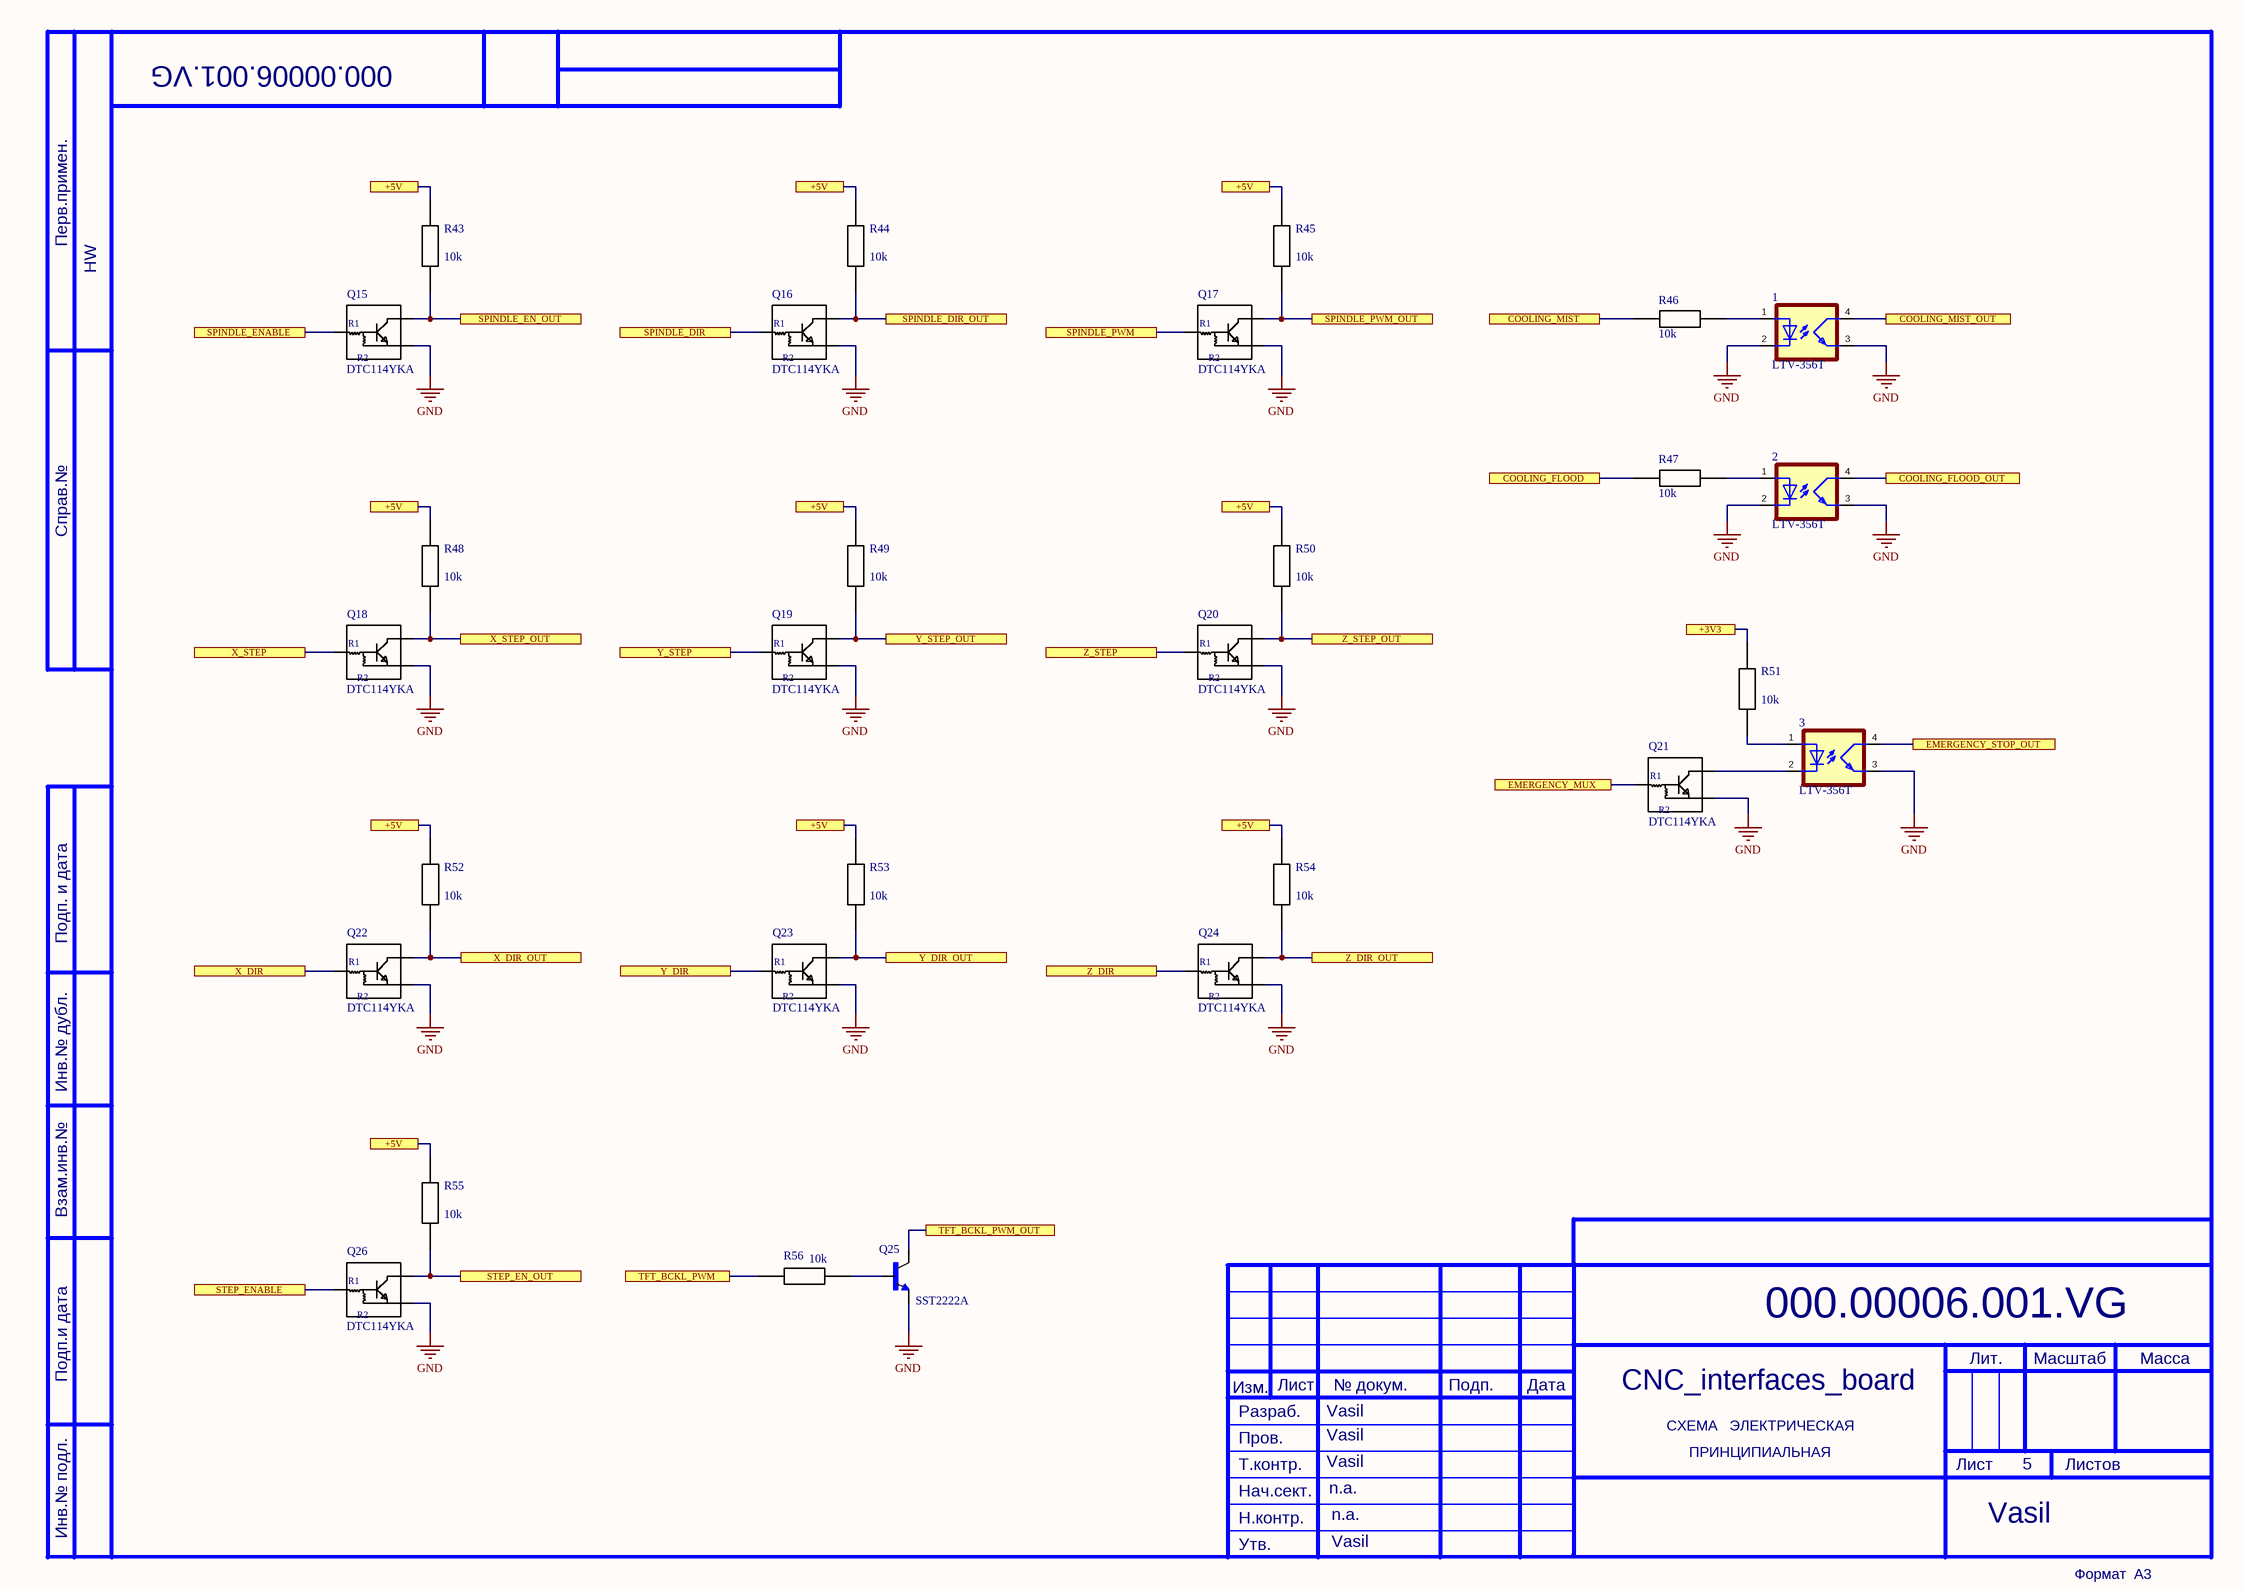
[diagram p4: Sheet5.SchDoc]

### Parts
1  LTV-356T  [MINI-FLAT-4]
2  LTV-356T  [MINI-FLAT-4]
3  LTV-356T  [MINI-FLAT-4]
Q15  DTC114YKA  [SOT-346 (SC59) Black]
Q16  DTC114YKA  [SOT-346 (SC59) Black]
Q17  DTC114YKA  [SOT-346 (SC59) Black]
Q18  DTC114YKA  [SOT-346 (SC59) Black]
Q19  DTC114YKA  [SOT-346 (SC59) Black]
Q20  DTC114YKA  [SOT-346 (SC59) Black]
Q21  DTC114YKA  [SOT-346 (SC59) Black]
Q22  DTC114YKA  [SOT-346 (SC59) Black]
Q23  DTC114YKA  [SOT-346 (SC59) Black]
Q24  DTC114YKA  [SOT-346 (SC59) Black]
Q25  SST2222A  [SOT-23-3]
Q26  DTC114YKA  [SOT-346 (SC59) Black]
R43  10k  [SMD 0805]
R44  10k  [SMD 0805]
R45  10k  [SMD 0805]
R46  10k  [SMD 0805]
R47  10k  [SMD 0805]
R48  10k  [SMD 0805]
R49  10k  [SMD 0805]
R50  10k  [SMD 0805]
R51  10k  [SMD 0805]
R52  10k  [SMD 0805]
R53  10k  [SMD 0805]
R54  10k  [SMD 0805]
R55  10k  [SMD 0805]
R56  10k  [SMD 0805]

### Ports
+3V3, +5V, COOLING_FLOOD, COOLING_FLOOD_OUT, COOLING_MIST, COOLING_MIST_OUT, EMERGENCY_MUX, EMERGENCY_STOP_OUT, SPINDLE_DIR, SPINDLE_DIR_OUT, SPINDLE_EN_OUT, SPINDLE_ENABLE, SPINDLE_PWM, SPINDLE_PWM_OUT, STEP_EN_OUT, STEP_ENABLE, TFT_BCKL_PWM, TFT_BCKL_PWM_OUT, X_DIR, X_DIR_OUT, X_STEP, X_STEP_OUT, Y_DIR, Y_DIR_OUT, Y_STEP, Y_STEP_OUT, Z_DIR, Z_DIR_OUT, Z_STEP, Z_STEP_OUT

### Nets
GND: 1.2(C) 1.3(EMIT) 2.2(C) 2.3(EMIT) 3.3(EMIT) Q15.2 Q16.2 Q17.2 Q18.2 Q19.2 Q20.2 Q21.2 Q22.2 Q23.2 Q24.2 Q25.2(E) Q26.2
Net1_1: 1.1(A) R46.2
Net1_4: 1.4(COL) ; port COOLING_MIST_OUT
Net2_1: 2.1(A) R47.2
Net2_4: 2.4(COL) ; port COOLING_FLOOD_OUT
Net3_1: 3.1(A) R51.2
Net3_2: 3.2(C) Q21.3
Net3_4: 3.4(COL) ; port EMERGENCY_STOP_OUT
NetC3_1: R43.1 R44.1 R45.1 R48.1 R49.1 R50.1 R52.1 R53.1 R54.1 R55.1 ; port +5V
NetD5_A: Q21.1 ; port EMERGENCY_MUX
NetJ3_6: R51.1 ; port +3V3
NetJ3_34: Q25.3(C) ; port TFT_BCKL_PWM_OUT
NetJ4_1: Q26.3 R55.2 ; port STEP_EN_OUT
NetJ4_2: Q18.3 R48.2 ; port X_STEP_OUT
NetJ4_3: Q19.3 R49.2 ; port Y_STEP_OUT
NetJ4_4: Q20.3 R50.2 ; port Z_STEP_OUT
NetJ4_5: Q22.3 R52.2 ; port X_DIR_OUT
NetJ4_6: Q23.3 R53.2 ; port Y_DIR_OUT
NetJ4_7: Q24.3 R54.2 ; port Z_DIR_OUT
NetJ5_1: Q17.3 R45.2 ; port SPINDLE_PWM_OUT
NetJ5_2: Q16.3 R44.2 ; port SPINDLE_DIR_OUT
NetJ5_3: Q15.3 R43.2 ; port SPINDLE_EN_OUT
NetQ15_1: Q15.1 ; port SPINDLE_ENABLE
NetQ16_1: Q16.1 ; port SPINDLE_DIR
NetQ17_1: Q17.1 ; port SPINDLE_PWM
NetQ18_1: Q18.1 ; port X_STEP
NetQ19_1: Q19.1 ; port Y_STEP
NetQ20_1: Q20.1 ; port Z_STEP
NetQ22_1: Q22.1 ; port X_DIR
NetQ23_1: Q23.1 ; port Y_DIR
NetQ24_1: Q24.1 ; port Z_DIR
NetQ25_1: Q25.1(B) R56.2
NetQ26_1: Q26.1 ; port STEP_ENABLE
NetR46_1: R46.1 ; port COOLING_MIST
NetR47_1: R47.1 ; port COOLING_FLOOD
NetR56_1: R56.1 ; port TFT_BCKL_PWM

### Notes on the sheet
- Перв.примен.
- Справ.№
- Подп. и дата
- Инв.№ дубл.
- Взам.инв.№
- Подп.и дата
- Разраб.
- Изм.
- Лист
- № докум.
- Подп.
- Дата
- Лит.
- Масштаб
- Масса
- Т.контр.
- Пров.
- СХЕМА   ЭЛЕКТРИЧЕСКАЯ
- ПРИНЦИПИАЛЬНАЯ
- Листов
- Инв.№ подл.
- Утв.
- Н.контр.
- Нач.сект.
- Формат  A3
- (in symbol DTC114YKA) R1; R2

### Library data of the parts
1-3 = LTV-356T: Optoisolator Transistor Output 3750Vrms 1 Channel 4-SOP; MF: Lite-On Inc.; Package: SOP-4 Lite-On Inc.; Availability: Unavailable; Value: LTV-356T; MP: LTV-356T; Price: None; SnapEDA_Link: https://www.snapeda.com/parts/LTV-356T/Lite-On%20Inc./view-part/448527/?ref=snap
Q15-Q24 Q26 = DTC114YKA: as Q4 on sheet Sheet4; HalpURL: https://store.comet.bg/Catalogue/Product/23715/; Case: SOT-346 (SC59); Value: DTC114YKA
Q25 = SST2222A: as Q1 on sheet Sheet2; Case: SOT-23-3 SST3; HelpURL: https://store.comet.bg/Catalogue/Product/23715/; Value: SST2222A
R43-R56 = Resistor_1: RES; HelpURL: https://store.comet.bg/Catalogue/RES/Resistors/#eyJpcHAiOiIxMDAiLCJtIjoiIn0%3D; Value: 10k

## Nets that join several sheets
GND: Sheet1 (17 pins), Sheet2 (21 pins), Sheet3 (12 pins), Sheet4 (11 pins), Sheet5 (17 pins)
Net1_4: Sheet2 (J6.3), Sheet5 (1.4)
Net2_4: Sheet2 (J6.2), Sheet5 (2.4)
Net3_4: Sheet2 (J6.1), Sheet5 (3.4)
NetC3_1: Sheet1 (5 pins), Sheet2 (J12.1 J12.2 J12.3 J12.4), Sheet3 (FB1.1), Sheet5 (10 pins)
NetD1_A: Sheet2 (D1.A), Sheet4 (Q12.3 R38.2)
NetD2_A: Sheet2 (D2.A), Sheet4 (Q13.3 R40.2)
NetD3_A: Sheet2 (D3.A), Sheet4 (Q14.3 R42.2)
NetD4_A: Sheet2 (D4.A), Sheet4 (Q8.3 R30.2)
NetD5_A: Sheet2 (D5.A Q1.3 R3.2), Sheet5 (Q21.1)
NetJ3_6: Sheet1 (6 pins), Sheet2 (18 pins), Sheet3 (6 pins), Sheet4 (22 pins), Sheet5 (R51.1)
NetJ3_9: Sheet1 (U1.30), Sheet2 (J3.9 R6.2)
NetJ3_10: Sheet1 (U1.31), Sheet2 (J3.10)
NetJ3_11: Sheet1 (U1.32), Sheet2 (J3.11)
NetJ3_12: Sheet1 (U1.33), Sheet2 (J3.12)
NetJ3_15: Sheet1 (U1.34), Sheet2 (J3.15 R5.2)
NetJ3_17: Sheet1 (U1.69), Sheet2 (J3.17)
NetJ3_18: Sheet1 (U1.70), Sheet2 (J3.18)
NetJ3_19: Sheet1 (U1.71), Sheet2 (J3.19)
NetJ3_20: Sheet1 (U1.72), Sheet2 (J3.20)
NetJ3_21: Sheet1 (U1.73), Sheet2 (J3.21)
NetJ3_22: Sheet1 (U1.74), Sheet2 (J3.22)
NetJ3_23: Sheet1 (U1.75), Sheet2 (J3.23)
NetJ3_24: Sheet1 (U1.76), Sheet2 (J3.24)
NetJ3_25: Sheet1 (U1.77), Sheet2 (J3.25)
NetJ3_26: Sheet1 (U1.78), Sheet2 (J3.26)
NetJ3_27: Sheet1 (U1.79), Sheet2 (J3.27)
NetJ3_28: Sheet1 (U1.80), Sheet2 (J3.28)
NetJ3_29: Sheet1 (U1.81), Sheet2 (J3.29)
NetJ3_30: Sheet1 (U1.82), Sheet2 (J3.30)
NetJ3_31: Sheet1 (U1.83), Sheet2 (J3.31)
NetJ3_32: Sheet1 (U1.84), Sheet2 (J3.32)
NetJ3_34: Sheet2 (J3.34 J3.35 J3.36), Sheet5 (Q25.3)
NetJ4_1: Sheet2 (J4.1), Sheet5 (Q26.3 R55.2)
NetJ4_2: Sheet2 (J4.2), Sheet5 (Q18.3 R48.2)
NetJ4_3: Sheet2 (J4.3), Sheet5 (Q19.3 R49.2)
NetJ4_4: Sheet2 (J4.4), Sheet5 (Q20.3 R50.2)
NetJ4_5: Sheet2 (J4.5), Sheet5 (Q22.3 R52.2)
NetJ4_6: Sheet2 (J4.6), Sheet5 (Q23.3 R53.2)
NetJ4_7: Sheet2 (J4.7), Sheet5 (Q24.3 R54.2)
NetJ5_1: Sheet2 (J5.1), Sheet5 (Q17.3 R45.2)
NetJ5_2: Sheet2 (J5.2), Sheet5 (Q16.3 R44.2)
NetJ5_3: Sheet2 (J5.3), Sheet5 (Q15.3 R43.2)
NetJ7_1: Sheet2 (J7.1), Sheet4 (Q12.1 R37.2)
NetJ7_2: Sheet2 (J7.2), Sheet4 (Q13.1 R39.2)
NetJ7_3: Sheet2 (J7.3), Sheet4 (Q14.1 R41.2)
NetJ8_2: Sheet1 (U1.28), Sheet2 (J8.2 R1.2)
NetJ8_3: Sheet1 (U1.29), Sheet2 (J8.3 R2.1)
NetJ8_4: Sheet1 (U1.66), Sheet2 (J8.4)
NetJ8_5: Sheet1 (U1.67), Sheet2 (J8.5 R4.1)
NetJ9_1: Sheet2 (J9.1), Sheet4 (Q4.1 R21.2)
NetJ9_2: Sheet2 (J9.2), Sheet4 (Q5.1 R23.2)
NetJ9_3: Sheet2 (J9.3), Sheet4 (Q6.1 R25.2)
NetJ9_4: Sheet2 (J9.4), Sheet4 (Q7.1 R27.2)
NetJ9_5: Sheet2 (J9.5), Sheet4 (Q9.1 R31.2)
NetJ9_6: Sheet2 (J9.6), Sheet4 (Q10.1 R33.2)
NetJ9_7: Sheet2 (J9.7), Sheet4 (Q11.1 R35.2)
NetJ9_8: Sheet2 (J9.8), Sheet4 (Q8.1 R29.2)
NetJ10_1: Sheet1 (U1.62), Sheet2 (J10.1)
NetJ10_2: Sheet1 (U1.61), Sheet2 (J10.2)
NetQ2_3: Sheet1 (U2.82), Sheet2 (Q2.3 R8.2)
NetQ4_3: Sheet1 (U2.12), Sheet4 (Q4.3 R22.2)
NetQ5_3: Sheet1 (U2.9), Sheet4 (Q5.3 R24.2)
NetQ6_3: Sheet1 (U2.10), Sheet4 (Q6.3 R26.2)
NetQ7_3: Sheet1 (U2.28), Sheet4 (Q7.3 R28.2)
NetQ9_3: Sheet1 (U2.83), Sheet4 (Q9.3 R32.2)
NetQ10_3: Sheet1 (U2.84), Sheet4 (Q10.3 R34.2)
NetQ11_3: Sheet1 (U2.85), Sheet4 (Q11.3 R36.2)
NetQ15_1: Sheet1 (U2.24), Sheet5 (Q15.1)
NetQ16_1: Sheet1 (U2.23), Sheet5 (Q16.1)
NetQ17_1: Sheet1 (U2.64), Sheet5 (Q17.1)
NetQ18_1: Sheet1 (U2.33), Sheet5 (Q18.1)
NetQ19_1: Sheet1 (U2.34), Sheet5 (Q19.1)
NetQ20_1: Sheet1 (U2.31), Sheet5 (Q20.1)
NetQ22_1: Sheet1 (U2.29), Sheet5 (Q22.1)
NetQ23_1: Sheet1 (U2.30), Sheet5 (Q23.1)
NetQ24_1: Sheet1 (U2.27), Sheet5 (Q24.1)
NetQ26_1: Sheet1 (U2.69), Sheet5 (Q26.1)
NetR10_2: Sheet1 (U1.47), Sheet3 (R10.2 SW1.1)
NetR11_2: Sheet1 (U1.49), Sheet3 (R11.2 SW2.1)
NetR12_2: Sheet1 (U1.51), Sheet3 (R12.2 SW3.1)
NetR13_2: Sheet1 (U1.53), Sheet3 (R13.2 SW4.1)
NetR14_2: Sheet1 (U1.55), Sheet3 (R14.2 SW5.1)
NetR15_2: Sheet1 (U1.57), Sheet3 (R15.2 SW6.1)
NetR16_1: Sheet1 (U1.42), Sheet3 (R16.1)
NetR17_1: Sheet1 (U1.40), Sheet3 (R17.1)
NetR18_1: Sheet1 (U1.38), Sheet3 (R18.1)
NetR19_1: Sheet1 (U1.36), Sheet3 (R19.1)
NetR20_1: Sheet1 (U1.6), Sheet3 (R20.1)
NetR46_1: Sheet1 (U2.81), Sheet5 (R46.1)
NetR47_1: Sheet1 (U2.80), Sheet5 (R47.1)
NetR56_1: Sheet1 (U1.68), Sheet5 (R56.1)